# Altium project BMS.PrjPcb
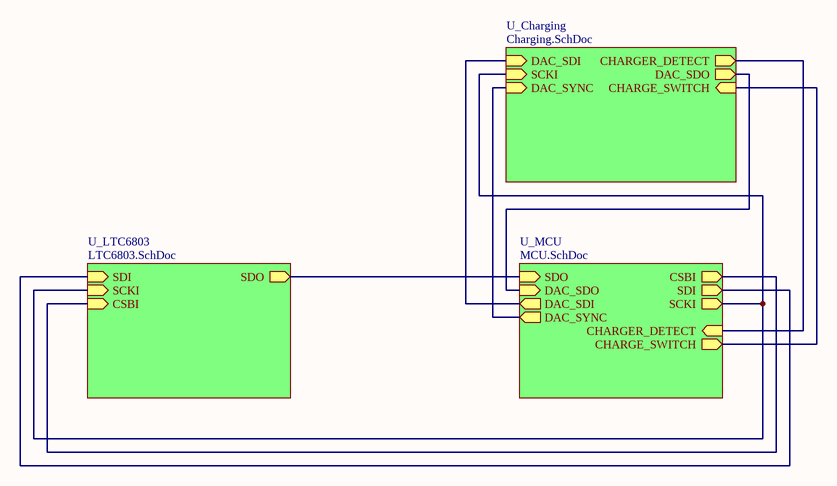
[diagram p0: BMS.SchDoc]
4 sheets, 170 parts. Net scope: hierarchical (ports join the sheet entries above them; power ports are global).
Board file: BMS.PcbDoc
Sheets:
  BMS.SchDoc
    U_LTC6803 = LTC6803.SchDoc
    U_MCU = MCU.SchDoc
    U_Charging = Charging.SchDoc

## Sheet BMS.SchDoc
size A

### Sub-sheets
U_Charging = Charging.SchDoc: CHARGER_DETECT (out), DAC_SDI (in), DAC_SDO (out), DAC_SYNC (in), SCKI (in), CHARGE_SWITCH (in)
U_LTC6803 = LTC6803.SchDoc: SDI (in), SCKI (in), SDO (out), CSBI (in)
U_MCU = MCU.SchDoc: CSBI (out), SDI (out), SDO (in), SCKI (out), DAC_SDO (in), DAC_SYNC (out), DAC_SDI (out), CHARGER_DETECT (in), CHARGE_SWITCH (out)

### Nets
NetR1_2: sheet U_LTC6803/SCKI, sheet U_MCU/SCKI, sheet U_Charging/SCKI
NetR2_2: sheet U_LTC6803/SDI, sheet U_MCU/SDI
NetR3_2: sheet U_LTC6803/CSBI, sheet U_MCU/CSBI
NetR6_2: sheet U_LTC6803/SDO, sheet U_MCU/SDO
NetR50_1: sheet U_MCU/CHARGER_DETECT, sheet U_Charging/CHARGER_DETECT
NetR64_2: sheet U_MCU/CHARGE_SWITCH, sheet U_Charging/CHARGE_SWITCH
NetU3_7: sheet U_MCU/DAC_SDI, sheet U_Charging/DAC_SDI
NetU3_8: sheet U_MCU/DAC_SDO, sheet U_Charging/DAC_SDO
NetU3_9: sheet U_MCU/DAC_SYNC, sheet U_Charging/DAC_SYNC

## Sheet LTC6803.SchDoc
size A
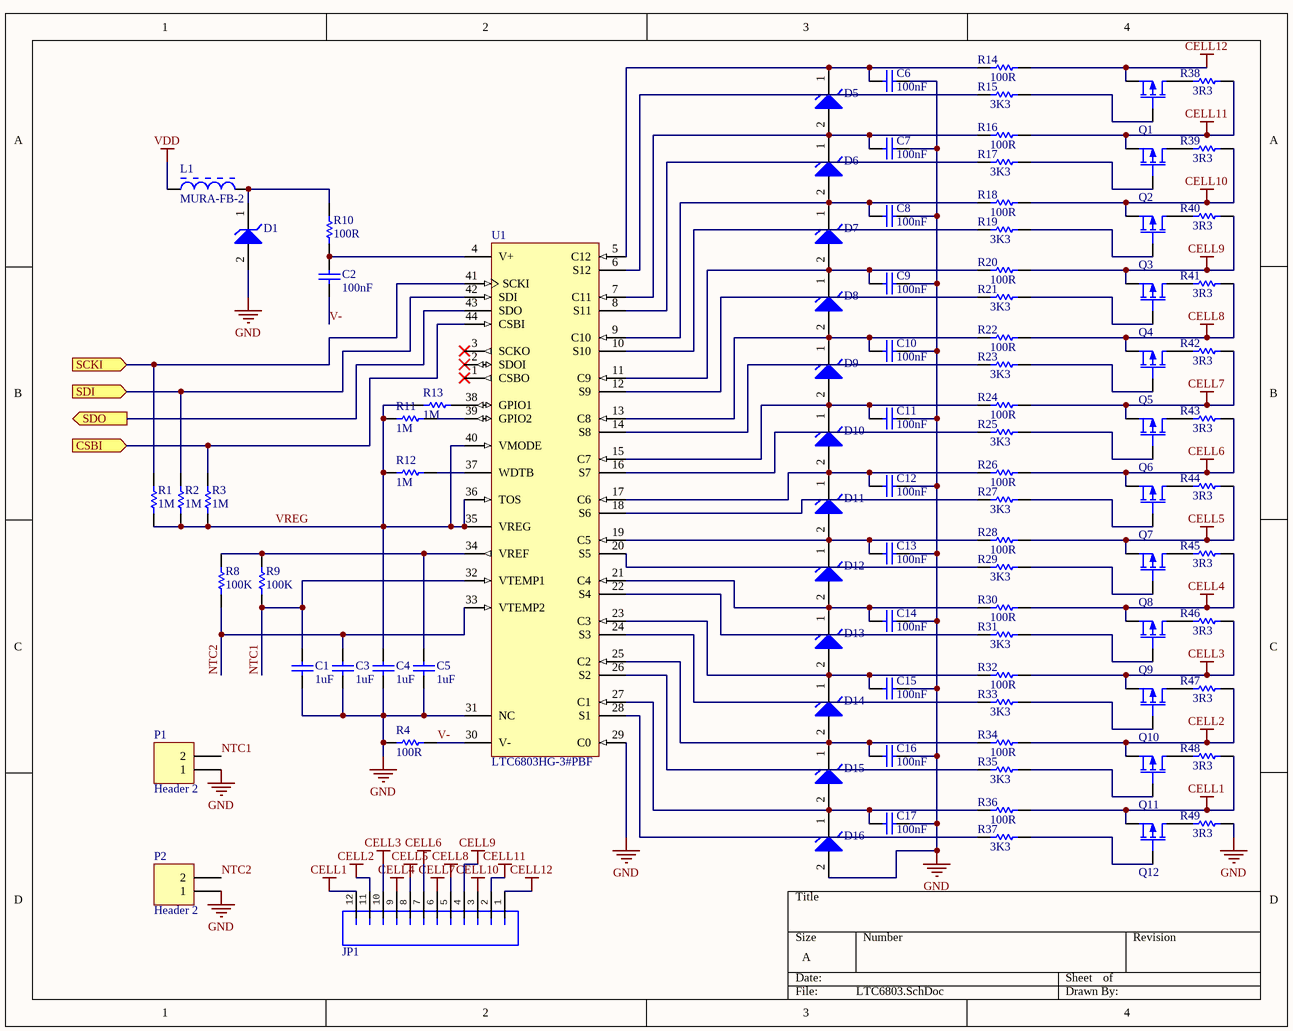
[diagram p1: LTC6803.SchDoc]

### Parts
C1  1uF  [CAPC0603(1608)100_N]
C2  100nF  [CAPC0603(1608)100_L]
C3  1uF  [CAPC0603(1608)100_N]
C4  1uF  [CAPC0603(1608)100_N]
C5  1uF  [CAPC0603(1608)100_N]
C6  100nF  [CAPC0603(1608)100_M]
C7  100nF  [CAPC0603(1608)100_M]
C8  100nF  [CAPC0603(1608)100_M]
C9  100nF  [CAPC0603(1608)100_M]
C10  100nF  [CAPC0603(1608)100_M]
C11  100nF  [CAPC0603(1608)100_M]
C12  100nF  [CAPC0603(1608)100_M]
C13  100nF  [CAPC0603(1608)100_M]
C14  100nF  [CAPC0603(1608)100_M]
C15  100nF  [CAPC0603(1608)100_M]
C16  100nF  [CAPC0603(1608)100_M]
C17  100nF  [CAPC0603(1608)100_M]
D1  (no value)  [SOD-123]
D5  (no value)  [ONSC-SOD-323-2-477-02_V]
D6  (no value)  [ONSC-SOD-323-2-477-02_V]
D7  (no value)  [ONSC-SOD-323-2-477-02_V]
D8  (no value)  [ONSC-SOD-323-2-477-02_V]
D9  (no value)  [ONSC-SOD-323-2-477-02_V]
D10  (no value)  [ONSC-SOD-323-2-477-02_V]
D11  (no value)  [ONSC-SOD-323-2-477-02_V]
D12  (no value)  [ONSC-SOD-323-2-477-02_V]
D13  (no value)  [ONSC-SOD-323-2-477-02_V]
D14  (no value)  [ONSC-SOD-323-2-477-02_V]
D15  (no value)  [ONSC-SOD-323-2-477-02_V]
D16  (no value)  [ONSC-SOD-323-2-477-02_V]
JP1  (no value)  [JST-12-PTH]
L1  MURA-FB-2  [MURA-BLM31-B60-CHIP-2_V1]
P1  Header 2  [HDR1X2]
P2  Header 2  [HDR1X2]
Q1  MOSFET-P  [SOT23-3]  (value not drawn)
Q2  MOSFET-P  [SOT23-3]  (value not drawn)
Q3  MOSFET-P  [SOT23-3]  (value not drawn)
Q4  MOSFET-P  [SOT23-3]  (value not drawn)
Q5  MOSFET-P  [SOT23-3]  (value not drawn)
Q6  MOSFET-P  [SOT23-3]  (value not drawn)
Q7  MOSFET-P  [SOT23-3]  (value not drawn)
Q8  MOSFET-P  [SOT23-3]  (value not drawn)
Q9  MOSFET-P  [SOT23-3]  (value not drawn)
Q10  MOSFET-P  [SOT23-3]  (value not drawn)
Q11  MOSFET-P  [SOT23-3]  (value not drawn)
Q12  MOSFET-P  [SOT23-3]  (value not drawn)
R1  1M  [RESC0603(1608)_L]
R2  1M  [RESC0603(1608)_L]
R3  1M  [RESC0603(1608)_L]
R4  100R  [RESC0603(1608)_L]
R8  100K  [RESC0603(1608)_N]
R9  100K  [RESC0603(1608)_N]
R10  100R  [RESC0603(1608)_L]
R11  1M  [RESC0603(1608)_L]
R12  1M  [RESC0603(1608)_L]
R13  1M  [RESC0603(1608)_L]
R14  100R  [RESC0603(1608)_N]
R15  3K3  [RESC0603(1608)_N]
R16  100R  [RESC0603(1608)_N]
R17  3K3  [RESC0603(1608)_N]
R18  100R  [RESC0603(1608)_N]
R19  3K3  [RESC0603(1608)_N]
R20  100R  [RESC0603(1608)_N]
R21  3K3  [RESC0603(1608)_N]
R22  100R  [RESC0603(1608)_N]
R23  3K3  [RESC0603(1608)_N]
R24  100R  [RESC0603(1608)_N]
R25  3K3  [RESC0603(1608)_N]
R26  100R  [RESC0603(1608)_N]
R27  3K3  [RESC0603(1608)_N]
R28  100R  [RESC0603(1608)_N]
R29  3K3  [RESC0603(1608)_N]
R30  100R  [RESC0603(1608)_N]
R31  3K3  [RESC0603(1608)_N]
R32  100R  [RESC0603(1608)_N]
R33  3K3  [RESC0603(1608)_N]
R34  100R  [RESC0603(1608)_N]
R35  3K3  [RESC0603(1608)_N]
R36  100R  [RESC0603(1608)_N]
R37  3K3  [RESC0603(1608)_N]
R38  3R3  [RESC2512(6432)_N]
R39  3R3  [RESC2512(6432)_N]
R40  3R3  [RESC2512(6432)_N]
R41  3R3  [RESC2512(6432)_N]
R42  3R3  [RESC2512(6432)_N]
R43  3R3  [RESC2512(6432)_N]
R44  3R3  [RESC2512(6432)_N]
R45  3R3  [RESC2512(6432)_N]
R46  3R3  [RESC2512(6432)_N]
R47  3R3  [RESC2512(6432)_N]
R48  3R3  [RESC2512(6432)_N]
R49  3R3  [RESC2512(6432)_N]
U1  LTC6803HG-3#PBF  [LT-G-44_L]

### Ports
CSBI (in), SCKI (in), SDI (in), SDO (out)

### Nets
CELL1: JP1.12 Q12.3(S) R36.2 R48.1
CELL2: JP1.11 Q11.3(S) R34.2 R47.1
CELL3: JP1.10 Q10.3(S) R32.2 R46.1
CELL4: JP1.9 Q9.3(S) R30.2 R45.1
CELL5: JP1.8 Q8.3(S) R28.2 R44.1
CELL6: JP1.7 Q7.3(S) R26.2 R43.1
CELL7: JP1.6 Q6.3(S) R24.2 R42.1
CELL8: JP1.5 Q5.3(S) R22.2 R41.1
CELL9: JP1.4 Q4.3(S) R20.2 R40.1
CELL10: JP1.3 Q3.3(S) R18.2 R39.1
CELL11: JP1.2 Q2.3(S) R16.2 R38.1
CELL12: JP1.1 Q1.3(S) R14.2
GND: C1.1 C3.1 C4.1 C5.1 C6.1 C7.1 C8.1 C9.1 C10.1 C11.1 C12.1 C13.1 C14.1 C15.1 C16.1 C17.1 D1.2(A) D16.2(A) P1.1 P2.1 R4.1 R49.1 U1.29(C0) U1.31(NC)
VDD: L1.1
NTC1: C1.2 P1.2 R9.1 U1.32(VTEMP1)
NTC2: C3.2 P2.2 R8.1 U1.33(VTEMP2)
V-: C2.1 R4.2 U1.30(V-)
VREG: C4.2 R1.1 R2.1 R3.1 R11.1 R12.1 R13.1 U1.35(VREG) U1.36(TOS) U1.40(VMODE)
NetC2_2: C2.2 R10.1 U1.4(V+)
NetC5_2: C5.2 R8.2 R9.2 U1.34(VREF)
NetC6_2: C6.2 D5.1(K) R14.1 U1.5(C12)
NetC7_2: C7.2 D5.2(A) D6.1(K) R16.1 U1.7(C11)
NetC8_2: C8.2 D6.2(A) D7.1(K) R18.1 U1.9(C10)
NetC9_2: C9.2 D7.2(A) D8.1(K) R20.1 U1.11(C9)
NetC10_2: C10.2 D8.2(A) D9.1(K) R22.1 U1.13(C8)
NetC11_2: C11.2 D9.2(A) D10.1(K) R24.1 U1.15(C7)
NetC12_2: C12.2 D10.2(A) D11.1(K) R26.1 U1.17(C6)
NetC13_2: C13.2 D11.2(A) D12.1(K) R28.1 U1.19(C5)
NetC14_2: C14.2 D12.2(A) D13.1(K) R30.1 U1.21(C4)
NetC15_2: C15.2 D13.2(A) D14.1(K) R32.1 U1.23(C3)
NetC16_2: C16.2 D14.2(A) D15.1(K) R34.1 U1.25(C2)
NetC17_2: C17.2 D15.2(A) D16.1(K) R36.1 U1.27(C1)
NetD1_1: D1.1(K) L1.2 R10.2
NetQ1_1: Q1.1(G) R15.2
NetQ1_2: Q1.2(D) R38.2
NetQ2_1: Q2.1(G) R17.2
NetQ2_2: Q2.2(D) R39.2
NetQ3_1: Q3.1(G) R19.2
NetQ3_2: Q3.2(D) R40.2
NetQ4_1: Q4.1(G) R21.2
NetQ4_2: Q4.2(D) R41.2
NetQ5_1: Q5.1(G) R23.2
NetQ5_2: Q5.2(D) R42.2
NetQ6_1: Q6.1(G) R25.2
NetQ6_2: Q6.2(D) R43.2
NetQ7_1: Q7.1(G) R27.2
NetQ7_2: Q7.2(D) R44.2
NetQ8_1: Q8.1(G) R29.2
NetQ8_2: Q8.2(D) R45.2
NetQ9_1: Q9.1(G) R31.2
NetQ9_2: Q9.2(D) R46.2
NetQ10_1: Q10.1(G) R33.2
NetQ10_2: Q10.2(D) R47.2
NetQ11_1: Q11.1(G) R35.2
NetQ11_2: Q11.2(D) R48.2
NetQ12_1: Q12.1(G) R37.2
NetQ12_2: Q12.2(D) R49.2
NetR1_2: R1.2 U1.41(SCKI) ; port SCKI
NetR2_2: R2.2 U1.42(SDI) ; port SDI
NetR3_2: R3.2 U1.44(CSBI) ; port CSBI
NetR6_2: U1.43(SDO) ; port SDO
NetR11_2: R11.2 U1.39(GPIO2)
NetR12_2: R12.2 U1.37(WDTB)
NetR13_2: R13.2 U1.38(GPIO1)
NetR15_1: R15.1 U1.6(S12)
NetR17_1: R17.1 U1.8(S11)
NetR19_1: R19.1 U1.10(S10)
NetR21_1: R21.1 U1.12(S9)
NetR23_1: R23.1 U1.14(S8)
NetR25_1: R25.1 U1.16(S7)
NetR27_1: R27.1 U1.18(S6)
NetR29_1: R29.1 U1.20(S5)
NetR31_1: R31.1 U1.22(S4)
NetR33_1: R33.1 U1.24(S3)
NetR35_1: R35.1 U1.26(S2)
NetR37_1: R37.1 U1.28(S1)

Not connected (* = marked no-connect by the designer): U1 1(CSBO)* 2(SDOI)* 3(SCKO)*

### Library data of the parts
C1 C3-C5 = CMP-1035-02730-1: CAP 1uF 6.3V Â±10% 0603 (1608 Metric) Thickness 1mm SMD; Case-EIA: 0603; Case-Metric: 1608; Rated Voltage: 6.3 V; Max Thickness: 1 mm; Technology: SMT; Tolerance: Â±10%; Value: 1uF
C2 = CMP-1035-02595-1: CAP 100nF 100V Â±10% 0603 (1608 Metric) Thickness 1mm SMD; Case-EIA: 0603; Case-Metric: 1608; Tolerance: Â±10%; Rated Voltage: 100 V; Value: 100nF; Technology: SMT; Max Thickness: 1 mm
C6-C17 = CMP-1035-02575-1: CAP 100nF 6.3V Â±5% 0603 (1608 Metric) Thickness 1mm SMD; Case-Metric: 1608; Case-EIA: 0603; Tolerance: Â±5%; Technology: SMT; Rated Voltage: 6.3 V; Max Thickness: 1 mm; Value: 100nF
D1 = CMHZ5265B
D5-D16 = CMP-1060-00726-1: Zener Voltage Regulator, 300 mW, 2-Pin SOD-323, Tape and Reel; Manufacturer: On Semiconductor; PartNumber: MM3Z12VT1; VZ Typ (V): 12; P Max (W): 0.3; Packing: Tape and Reel; ComponentLink3URL: http://www.onsemi.com/pub_link/Collateral/477-02.PDF.1; ComponentLink2Description: Datasheet; Mounting Technology: Surface Mount; PackageVersion: Rev. H, 03/2007; PackageDescription: 2-Pin SOD, Body 1.7 x 1.25 mm; ComponentLink1URL: http://www.onsemi.com/; ComponentLink1Description: Manufacturer URL; ComponentLink3Description: Package Specification; ComponentLink2URL: http://www.onsemi.cn/pub_link/Collateral/MM3Z2V4T1-D.PDF; DatasheetVersion: Rev. 9; PackageReference: SOD-323-2-477-02
JP1 = JST_12_RIGHT
P1 P2 = Header 2: Header, 2-Pin; LatestRevisionDate: 17-Jul-2002; LatestRevisionNote: Re-released for DXP Platform.; Publisher: Altium Limited
Q1-Q12 = MOSFET-P: P-Channel MOSFET; Published: 8-Jun-2000; LatestRevisionDate: 17-Jul-2002; LatestRevisionNote: Re-released for DXP Platform.; PackageVersion: 1995/1996; PackageReference: E3; Publisher: Altium Limited; PackageDescription: TO, Flat Index; 3 In-Line, Axial Leads; Body Dia. 4.6mm; Lead Dia. 0.5 mm (max)
R1-R3 R11-R13 = CMP-1012-00849-1: 1M 0.1W 1% 0603 (1608 Metric)  SMD; Value: 1000000.00 Ohm; Case-EIA: 0603; Case-Metric: 1608; Power: 0.1 W; Tolerance: 1 %; Technology: SMT
R4 R10 R14 R16 R18 R20 R22 R24 R26 R28 R30 R32 R34 R36 = CMP-1012-00050-1: 100R 0.1W 5% 0603 (1608 Metric)  SMD; Case-EIA: 0603; Value: 100.00 Ohm; Case-Metric: 1608; Tolerance: 5 %; Technology: SMT; Power: 0.1 W
R8 R9 = CMP-1012-00122-1: 100K 0.1W 5% 0603 (1608 Metric)  SMD; Case-EIA: 0603; Value: 100000.00 Ohm; Case-Metric: 1608; Tolerance: 5 %; Power: 0.1 W; Technology: SMT
R15 R17 R19 R21 R23 R25 R27 R29 R31 R33 R35 R37 = CMP-1012-00086-1: 3K3 0.1W 5% 0603 (1608 Metric)  SMD; Case-EIA: 0603; Value: 3300.00 Ohm; Case-Metric: 1608; Technology: SMT; Tolerance: 5 %; Power: 0.1 W
R38-R49 = CMP-1018-00014-1: 3R3 1W 5% 2512 (6432 Metric)  SMD; Value: 3.30 Ohm; Case-EIA: 2512; Case-Metric: 6432; Tolerance: 5 %; Technology: SMT; Power: 1 W
U1 = CMP-0471-00238-1: Multicell Battery Stack Monitor, 60 V Vin MAX, 44-pin SOP (G-44), -40 to 125 degC, Pb-Free; Manufacturer: Linear Technology; Number of Cells: > 1000 V of stacked Li-Ion cells; Vin Max(V): 60; Battery Chemistry: Li-Ion, Supercapacitors, Multi-Chemistry; ComponentLink2URL: http://cds.linear.com/docs/en/datasheet/680313fa.pdf; ComponentLink1URL: http://www.linear.com/; PackageReference: G-44; DatasheetVersion: Rev. A; RoHS: TRUE; Mounting Technology: Surface Mount; ComponentLink3Description: Package Specification; PartNumber: LTC6803HG-3#PBF; Type of Charger: Battery Stack Monitor; PackageVersion: Rev. Ã˜, 06/2010; ComponentLink1Description: Manufacturer URL; PackageDescription: 44-Pin Plastic SSOP, Body 12.8 x 5.3 mm, Pitch 0.5 mm; ComponentLink3URL: http://cds.linear.com/docs/en/packaging/SSOP_44_05-08-1754.pdf; ComponentLink2Description: Datasheet

## Sheet MCU.SchDoc
size A
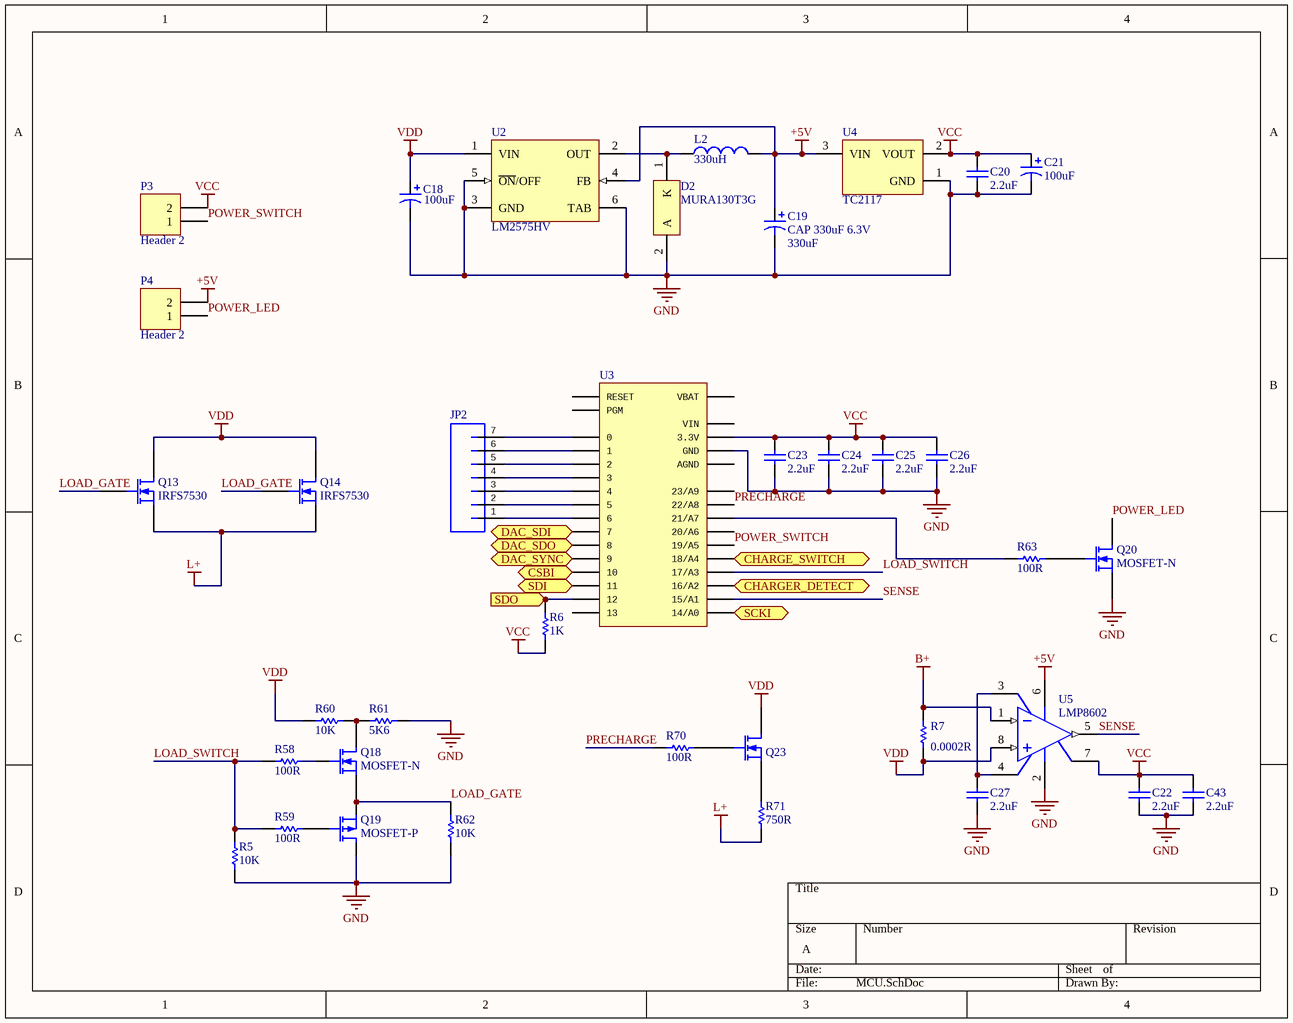
[diagram p2: MCU.SchDoc]

### Parts
C18  value 100uF  [CAP 180uF 50V]
C19  CAP 330uF 6.3V  value 330uF  [CAP 300uF 6.3V]
C20  2.2uF  [CAPC0603(1608)55_N]
C21  100uF  [AVX-CAPC7343_V]
C22  2.2uF  [CAPC0603(1608)55_M]
C23  2.2uF  [CAPC0603(1608)55_N]
C24  2.2uF  [CAPC0603(1608)55_N]
C25  2.2uF  [CAPC0603(1608)55_N]
C26  2.2uF  [CAPC0603(1608)55_N]
C27  2.2uF  [CAPC0603(1608)55_N]
C43  2.2uF  [CAPC0603(1608)55_M]
D2  MURA130T3G  [ONSC-SMA-2-403D-02_V]
JP2  (no value)  [JST-7-PTH]
L2  value 330uH  [SDR1307]
P3  Header 2  [HDR1X2]
P4  Header 2  [HDR1X2]
Q13  IRFS7530  [DPAK127P1525X483-7N]
Q14  IRFS7530  [DPAK127P1525X483-7N]
Q18  MOSFET-N  [SOT23-3]
Q19  MOSFET-P  [SOT23-3]
Q20  MOSFET-N  [SOT23-3]
Q23  MOSFET-N  [SOT23-3]  (value not drawn)
R5  10K  [RESC0603(1608)_N]
R6  1K  [RESC0603(1608)_L]
R7  value 0.0002R  [WSLP5931]
R58  100R  [RESC0603(1608)_L]
R59  100R  [RESC0603(1608)_L]
R60  10K  [RESC0603(1608)_N]
R61  5K6  [RESC0603(1608)_M]
R62  10K  [RESC0603(1608)_N]
R63  100R  [RESC0603(1608)_L]
R70  100R  [RESC0603(1608)_L]
R71  750R  [RESC2512(6432)_N]
U2  LM2575HV  [TS5B_L]
U3  (no value)  [TEENSY_3.0_BASIC]
U4  TC2117  [SOT-223-DB3_M]
U5  LMP8602  [M08A_M]

### Ports
CHARGE_SWITCH (out), CHARGER_DETECT (in), CSBI (out), DAC_SDI (out), DAC_SDO (in), DAC_SYNC (out), SCKI (out), SDI (out), SDO (in)

### Nets
+5V: C19.1 L2.2 P4.2 U2.4(FB) U4.3(VIN) U5.6(VS)
B+: R7.2 U5.1(IN-)
GND: C18.2 C19.2 C20.2 C21.2 C22.1 C23.1 C24.1 C25.1 C26.1 C27.1 C43.1 D2.2(A) Q19.2(D) Q20.3(S) R5.1 R61.1 R62.1 U2.3(GND) U2.5(~{ON}/OFF) U2.6(TAB) U3.GND_GND1(GND) U4.1(GND) U5.2(GND)
L+: Q13.3(S) Q14.3(S) R71.1
VCC: C20.1 C21.1 C22.2 C23.2 C24.2 C25.2 C26.2 C43.2 P3.2 R6.1 U3.3.3V_3.3V1(3.3V) U4.2(VOUT) U5.7(OFS)
VDD: C18.1 Q13.1(D) Q14.1(D) Q23.2(D) R7.1 R60.2 U2.1(VIN) U5.8(IN+)
LOAD_GATE: Q13.2(G) Q14.2(G) Q18.3(S) Q19.3(S) R62.2
LOAD_SWITCH: R5.2 R58.1 R59.1 U3.17/A3
POWER_LED: P4.1 Q20.2(D)
POWER_SWITCH: P3.1 U3.19/A5
PRECHARGE: R70.1 U3.22/A8
SENSE: U3.15/A1 U5.5(OUT)
NetC27_2: C27.2 U5.3(A1) U5.4(A2)
NetD2_1: D2.1(K) L2.1 U2.2(OUT)
NetJP2_1: JP2.1 U3.6
NetJP2_2: JP2.2 U3.5
NetJP2_3: JP2.3 U3.4
NetJP2_4: JP2.4 U3.3
NetJP2_5: JP2.5 U3.2
NetJP2_6: JP2.6 U3.1
NetJP2_7: JP2.7 U3.0
NetQ18_1: Q18.1(G) R58.2
NetQ18_2: Q18.2(D) R60.1 R61.2
NetQ19_1: Q19.1(G) R59.2
NetQ20_1: Q20.1(G) R63.2
NetQ23_1: Q23.1(G) R70.2
NetQ23_3: Q23.3(S) R71.2
NetR1_2: U3.14/A0 ; port SCKI
NetR2_2: U3.11 ; port SDI
NetR3_2: U3.10 ; port CSBI
NetR6_2: R6.2 U3.12 ; port SDO
NetR50_1: U3.16/A2 ; port CHARGER_DETECT
NetR63_1: R63.1 U3.21/A7
NetR64_2: U3.18/A4 ; port CHARGE_SWITCH
NetU3_7: U3.7 ; port DAC_SDI
NetU3_8: U3.8 ; port DAC_SDO
NetU3_9: U3.9 ; port DAC_SYNC

Not connected (* = marked no-connect by the designer): U3 13 20/A6 23/A9 AGND PGM RESET VBAT VIN

### Library data of the parts
C18 = CAP 100uF 63V: Polarized Capacitor (Axial); Published: 8-Jun-2000; LatestRevisionDate: 17-Jul-2002; LatestRevisionNote: Re-released for DXP Platform.; PackageReference: POLAR0.8; Publisher: Altium Limited; PackageDescription: Polarized Capacitor; 2 Leads
C19 = CAP 330uF 6.3V: Polarized Capacitor (Axial); Published: 8-Jun-2000; LatestRevisionDate: 17-Jul-2002; LatestRevisionNote: Re-released for DXP Platform.; PackageReference: POLAR0.8; Publisher: Altium Limited; PackageDescription: Polarized Capacitor; 2 Leads
C20 C23-C27 = CMP-1035-02762-1: CAP 2.2uF 16V Â±10% 0603 (1608 Metric) Thickness 0.55mm SMD; Case-EIA: 0603; Case-Metric: 1608; Max Thickness: 0.55 mm; Technology: SMT; Value: 2.2uF; Rated Voltage: 16 V; Tolerance: Â±10%
C21 = CMP-0279-00002-1: Capacitor, Tantalum, 220uF 10% 10V MCCT-D (7343-31); PartNumber: TAJD227K010R; Manufacturer: AVX; Polarity: Polarized; ComponentLink2URL: http://www.avx.com/docs/Catalogs/taj.pdf; PackageReference: CAPC7343; ComponentLink2Description: Datasheet; ComponentLink1URL: http://www.avx.com/; Mounting Technology: Surface Mount; Technology: Tantalum; Tolerance: 10%; Capacitance: 220uF; Rated Voltage: 10V; PackageDescription: 2-Pin SMT Capacitor, 7.3 x 4.3 mm Body; ComponentLink1Description: Manufacturer URL; DatasheetVersion: Jul-13
C22 C43 = CMP-1035-02751-1: CAP 2.2uF 4V Â±10% 0603 (1608 Metric) Thickness 0.55mm SMD; Case-EIA: 0603; Case-Metric: 1608; Tolerance: Â±10%; Rated Voltage: 4 V; Technology: SMT; Max Thickness: 0.55 mm; Value: 2.2uF
D2 = CMP-0902-00297-1: Surface Mount Ultrafast Power Rectifier, 2-Pin SMA, Pb-Free, Tape and Reel; Manufacturer: On Semiconductor; IFSM Max (A): 35; PackageDescription: 2-Pin Small Molded Package, J-Bend Lead, Body 2.605 x 4.315 mm; ComponentLink1URL: http://www.onsemi.com/; ComponentLink2Description: Datasheet; PackageVersion: Rev. G, 07/2012; PackageReference: SMA-2-403D-02; DatasheetVersion: Rev. 5; Packing: Tape and Reel; ComponentLink2URL: http://www.onsemi.cn/pub_link/Collateral/MURA130T3-D.PDF; Type: Ultrafast; RoHS: TRUE; ComponentLink1Description: Manufacturer URL; ComponentLink3Description: Package Specification; ComponentLink3URL: http://www.onsemi.com/pub_link/Collateral/403D-02.PDF; Mounting Technology: Surface Mount; PartNumber: MURA130T3G
JP2 = JST_7_RIGHT
L2 = SDR1307-331KL: Inductor; Code_IEC: 1005; Published: 8-Jun-2000; LatestRevisionDate: 29-May-2009; LatestRevisionNote: IPC-7351 Footprint Added.; PackageReference: 0402-A; Publisher: Altium Limited; PackageDescription: Chip Inductor; Code_JEITA: 0402
P3 P4 = Header 2: Header, 2-Pin; LatestRevisionDate: 17-Jul-2002; LatestRevisionNote: Re-released for DXP Platform.; Publisher: Altium Limited
Q13 Q14 = IRFS7530: N-Channel MOSFET; pin to pad: 1>8 2>1 3>2+3+5+6+7; Published: 8-Jun-2000; LatestRevisionDate: 17-Jul-2002; LatestRevisionNote: Re-released for DXP Platform.; PackageVersion: 1995/1996; PackageReference: E3; Publisher: Altium Limited; PackageDescription: TO, Flat Index; 3 In-Line, Axial Leads; Body Dia. 4.6mm; Lead Dia. 0.5 mm (max)
Q18 Q20 Q23 = MOSFET-N: N-Channel MOSFET; Published: 8-Jun-2000; LatestRevisionDate: 17-Jul-2002; LatestRevisionNote: Re-released for DXP Platform.; PackageVersion: 1995/1996; PackageReference: E3; Publisher: Altium Limited; PackageDescription: TO, Flat Index; 3 In-Line, Axial Leads; Body Dia. 4.6mm; Lead Dia. 0.5 mm (max)
Q19 = MOSFET-P: P-Channel MOSFET; Published: 8-Jun-2000; LatestRevisionDate: 17-Jul-2002; LatestRevisionNote: Re-released for DXP Platform.; PackageVersion: 1995/1996; PackageReference: E3; Publisher: Altium Limited; PackageDescription: TO, Flat Index; 3 In-Line, Axial Leads; Body Dia. 4.6mm; Lead Dia. 0.5 mm (max)
R5 R62 = CMP-1012-00623-1: 10K 0.1W 1% 0603 (1608 Metric)  SMD; Value: 10000.00 Ohm; Case-EIA: 0603; Case-Metric: 1608; Power: 0.1 W; Tolerance: 1 %; Technology: SMT
R6 = CMP-1012-00074-1: 1K 0.1W 5% 0603 (1608 Metric)  SMD; Case-EIA: 0603; Case-Metric: 1608; Value: 1000.00 Ohm; Technology: SMT; Tolerance: 5 %; Power: 0.1 W
R7 = SHUNT: Resistor; Published: 8-Jun-2000; LatestRevisionDate: 17-Jul-2002; LatestRevisionNote: Re-released for DXP Platform.; PackageReference: AXIAL-0.3; Publisher: Altium Limited; PackageDescription: Axial Device, Thru-Hole; 2 Leads; 0.3 in Pin Spacing
R58 R59 R63 R70 = CMP-1012-00050-1: as R4 on sheet LTC6803; Tolerance: 5 %; Technology: SMT; Power: 0.1 W
R60 = CMP-1012-00098-1: 10K 0.1W 5% 0603 (1608 Metric)  SMD; Case-EIA: 0603; Value: 10000.00 Ohm; Case-Metric: 1608; Technology: SMT; Tolerance: 5 %; Power: 0.1 W
R61 = CMP-1012-00595-1: 5K6 0.1W 1% 0603 (1608 Metric)  SMD; Value: 5600.00 Ohm; Case-Metric: 1608; Case-EIA: 0603; Tolerance: 1 %; Power: 0.1 W; Technology: SMT
R71 = CMP-1018-00496-1: 750R 1W 1% 2512 (6432 Metric)  SMD; Value: 750.00 Ohm; Case-EIA: 2512; Case-Metric: 6432; Tolerance: 1 %; Technology: SMT; Power: 1 W
U2 = CMP-0069-00099-2: SIMPLE SWITCHERÂ® 1A Step-Down Voltage Regulator, 5-pin TO-263, Pb-Free; Manufacturer: National Semiconductor; PackageTopMarking: NSUZXYTTE#*LM2575HVS*-5.0 P+; PowerWise: N; ComponentLink1URL: http://www.national.com/ds/LM/LM2575HV.pdf; ComponentLink2Description: LM2575HV Web Page; ComponentLink1Description: LM2575HV Datasheet; ComponentLink3URL: http://www.national.com/packaging/folders/ts5b.html; DatasheetVersion: Apr-2007; ComponentLink2URL: http://www.national.com/pf/LM/LM2575HV.html; PackageDescription: TO-263, Molded, .400 x .390 x .180in, 5 Lead, .067in Pitch, Surface Mount; PackageVersion: revD, Apr-2005; RoHS: Y; PackageReference: TS5B; CompType: Switcher; Code_JEDEC: MO-169-AB; ComponentLink3Description: TS5B Package Page; RevisionNote: Component URLs added; PinCount: 5
U3 = TEENSY_3.0_BASIC: pin to pad: 3.3V 3.3V1>3.3V+3.3V1 GND GND1>GND+GND1
U4 = PM-LINEREG-TC2117-IL4
U5 = CMP-0055-00659-1: 60V Common Mode, 50 x Gain, Bidirectional Precision Current Sensing Amplifier, 8 pin SOIC NARROW; Manufacturer: National Semiconductor; PowerWise: N; CompType: Amplifiers; PackageTopMarking: NSZXTT*LMP86*02QMA; Code_JEDEC: MS-012-AA; PackageDescription: SOIC Narrow, 4.9 x 3.9 x 1.45mm, 8 Lead, 1.27mm Pitch; RoHS: Y; PinCount: 8; PackageVersion: revM, May-2009; Code_IPC: SOIC127P600-8; DatasheetVersion: Mar-2010; PackageReference: M08A

## Sheet Charging.SchDoc
size A
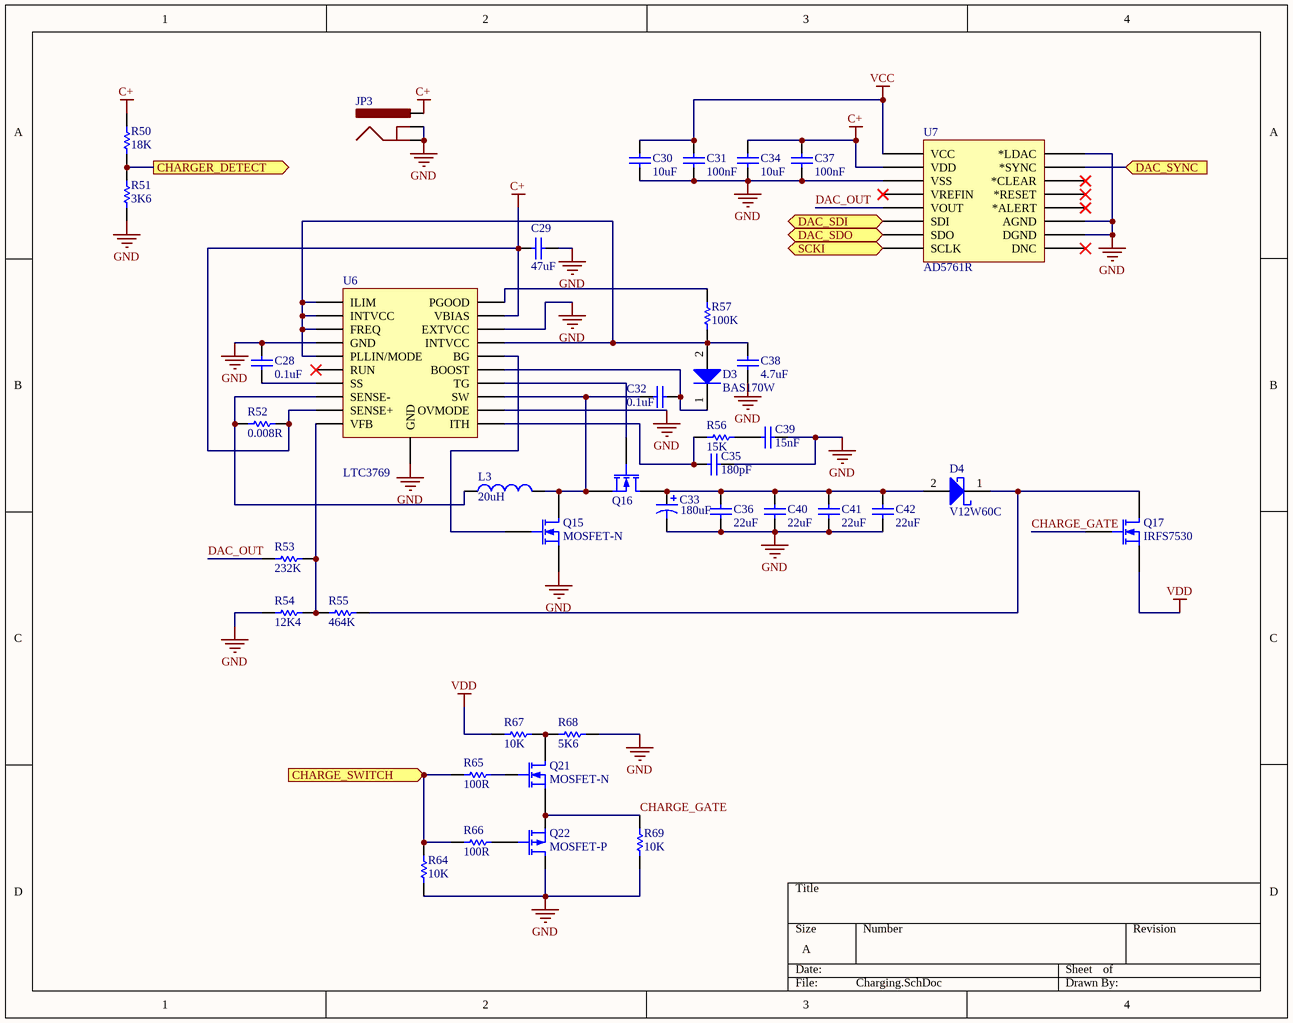
[diagram p3: Charging.SchDoc]

### Parts
C28  0.1uF  [CAPC0603(1608)100_M]
C29  47uF  [CAPC1206(3216)190_M]
C30  10uF  [CAPC0805(2012)145_N]
C31  100nF  [CAPC0603(1608)100_N]
C32  0.1uF  [CAPC0603(1608)100_M]
C33  value 180uF  [CAP 180uF 50V]
C34  10uF  [CAPC0805(2012)145_N]
C35  180pF  [CAPC0603(1608)100_M]
C36  22uF  [CAPC2220(5750)230_N]
C37  100nF  [CAPC0603(1608)100_N]
C38  4.7uF  [CAPC0603(1608)55_M]
C39  15nF  [CAPC0603(1608)100_L]
C40  22uF  [CAPC2220(5750)230_N]
C41  22uF  [CAPC2220(5750)230_N]
C42  22uF  [CAPC2220(5750)230_N]
D3  BAS170W  [INF-SOD323_V]
D4  V12W60C  [DPAK229P1003X238-3N]
JP3  (no value)  [POWER_JACK_SMD_OVERPASTE_REDBOARD_0603]
L3  value 20uH  [Inductor_LR]
Q15  MOSFET-N  [SOIC127P600X175-8N]
Q16  (no value)  [SOIC127P600X175-8N]
Q17  IRFS7530  [DPAK127P1525X483-7N]
Q21  MOSFET-N  [SOT23-3]
Q22  MOSFET-P  [SOT23-3]
R50  18K  [RESC0603(1608)_M]
R51  3K6  [RESC0603(1608)_L]
R52  0.008R  [RESC2010(5025)_L]
R53  232K  [RESC0603(1608)_N]
R54  12K4  [RESC0603(1608)_M]
R55  464K  [RESC0603(1608)_M]
R56  15K  [RESC0603(1608)_M]
R57  100K  [RESC0603(1608)_N]
R64  10K  [RESC0603(1608)_N]
R65  100R  [RESC0603(1608)_L]
R66  100R  [RESC0603(1608)_L]
R67  10K  [RESC0603(1608)_N]
R68  5K6  [RESC0603(1608)_M]
R69  10K  [RESC0603(1608)_N]
U6  LTC3769  [TSOP65P640X120_HS-21N]
U7  AD5761R  [RU_16]

### Ports
CHARGE_SWITCH (in), CHARGER_DETECT (out), DAC_SDI (in), DAC_SDO (out), DAC_SYNC (in), SCKI (in)

### Nets
C+: C29.1 C34.2 C37.2 JP3.VIN0(PWR) R50.2 R52.2 U6.9(SENSE+) U6.19(VBIAS) U7.8(VDD)
GND: C28.2 C29.2 C30.1 C31.1 C33.2 C34.1 C35.2 C36.1 C37.1 C38.1 C39.2 C40.1 C41.1 C42.1 JP3.GND(GNDBREAK) JP3.P$4(GND) Q15.3(S) Q22.2(D) R51.1 R54.1 R64.1 R68.1 R69.1 U6.4(GND) U6.12(OVMODE) U6.18(EXTVCC) U6.21(GND) U7.5(AGND) U7.6(VSS) U7.11(*LDAC) U7.16(DGND)
VCC: C30.2 C31.2 U7.15(VCC)
VDD: Q17.3(S) R67.2
CHARGE_GATE: Q17.2(G) Q21.3(S) Q22.3(S) R69.2
DAC_OUT: R53.1 U7.7(VOUT)
NetC28_1: C28.1 U6.7(SS)
NetC32_1: C32.1 L3.2 Q15.2(D) Q16.3(S) U6.13(SW)
NetC32_2: C32.2 D3.1(K) U6.15(BOOST)
NetC33_1: C33.1 C36.2 C40.2 C41.2 C42.2 D4.2(A) Q16.2(D)
NetC35_1: C35.1 R56.1 U6.11(ITH)
NetC38_2: C38.2 D3.2(A) R57.1 U6.1(ILIM) U6.2(INTVCC) U6.3(FREQ) U6.5(PLLIN/MODE) U6.17(INTVCC)
NetC39_1: C39.1 R56.2
NetD4_1: D4.1(K) Q17.1(D) R55.2
NetL3_1: L3.1 R52.1 U6.8(SENSE-)
NetQ15_1: Q15.1(G) U6.16(BG)
NetQ16_1: Q16.1(G) U6.14(TG)
NetQ21_1: Q21.1(G) R65.2
NetQ21_2: Q21.2(D) R67.1 R68.2
NetQ22_1: Q22.1(G) R66.2
NetR1_2: U7.14(SCLK) ; port SCKI
NetR50_1: R50.1 R51.2 ; port CHARGER_DETECT
NetR53_2: R53.2 R54.2 R55.1 U6.10(VFB)
NetR57_2: R57.2 U6.20(PGOOD)
NetR64_2: R64.2 R65.1 R66.1 ; port CHARGE_SWITCH
NetU3_7: U7.12(SDI) ; port DAC_SDI
NetU3_8: U7.10(SDO) ; port DAC_SDO
NetU3_9: U7.13(*SYNC) ; port DAC_SYNC

Not connected (* = marked no-connect by the designer): U6 6(RUN)*; U7 1(*ALERT)* 2(*CLEAR)* 3(*RESET)* 4(VREFIN)* 9(DNC)*

### Library data of the parts
C28 C32 = CMP-1035-02575-1: as C6 on sheet LTC6803; Tolerance: Â±5%; Technology: SMT; Rated Voltage: 6.3 V; Max Thickness: 1 mm; Value: 100nF
C29 = CMP-1037-04995-1: CAP 22uF 25V Â±20% 1206 (3216 Metric) Thickness 1.9mm SMD; Case-EIA: 1206; Case-Metric: 3216; Tolerance: Â±20%; Rated Voltage: 25 V; Technology: SMT; Max Thickness: 1.9 mm; Value: 22uF
C30 C34 = CMP-1036-04932-1: CAP 10uF 25V Â±10% 0805 (2012 Metric) Thickness 1.45mm SMD; Case-EIA: 0805; Case-Metric: 2012; Technology: SMT; Value: 10uF; Rated Voltage: 25 V; Max Thickness: 1.45 mm; Tolerance: Â±10%
C31 C37 = CMP-1035-02587-1: CAP 100nF 25V Â±5% 0603 (1608 Metric) Thickness 1mm SMD; Case-EIA: 0603; Case-Metric: 1608; Technology: SMT; Tolerance: Â±5%; Max Thickness: 1 mm; Rated Voltage: 25 V; Value: 100nF
C33 = CAP 180uF 50V: Polarized Capacitor (Axial); Published: 8-Jun-2000; LatestRevisionDate: 17-Jul-2002; LatestRevisionNote: Re-released for DXP Platform.; PackageReference: POLAR0.8; Publisher: Altium Limited; PackageDescription: Polarized Capacitor; 2 Leads
C35 = CMP-1035-01398-1: CAP 180pF 6.3V Â±5% 0603 (1608 Metric) Thickness 1mm SMD; Case-Metric: 1608; Case-EIA: 0603; Tolerance: Â±5%; Technology: SMT; Max Thickness: 1 mm; Rated Voltage: 6.3 V; Value: 180pF
C36 C40-C42 = CMP-1042-00782-1: CAP 22uF 50V -20% to +80% 2220 (5750 Metric) Thickness 2.2mm SMD; Case-EIA: 2220; Case-Metric: 5750; Max Thickness: 2.2 mm; Tolerance: -20% to +80%; Technology: SMT; Rated Voltage: 50 V; Value: 22uF
C38 = CMP-1035-02779-1: CAP 4.7uF 6.3V Â±10% 0603 (1608 Metric) Thickness 0.55mm SMD; Case-EIA: 0603; Case-Metric: 1608; Technology: SMT; Tolerance: Â±10%; Value: 4.7uF; Max Thickness: 0.55 mm; Rated Voltage: 6.3 V
C39 = CMP-1035-02358-1: CAP 15nF 6.3V Â±5% 0603 (1608 Metric) Thickness 1mm SMD; Case-Metric: 1608; Case-EIA: 0603; Rated Voltage: 6.3 V; Value: 15nF; Tolerance: Â±5%; Technology: SMT; Max Thickness: 1 mm
D3 = CMP-1182-00005-1: Silicon Schottky Diode, -55 to 125 degC, SOD323, Reel, Green; Manufacturer: Infineon; Green: TRUE; VF (max): 1,000Â mV; VR (max): 70Â V; Configuration: Single; CT (max): 2Â pF; IF (max): 70Â mA; PackageReference: SOD323; PartNumber: BAS170W; ComponentLink3URL: http://www.infineon.com/dgdl/SOD323-Package_Overview.pdf?folderId=db3a30431936bc4b011952aab84f3bbe&fileId=db3a30431936bc4b011952beed653be3; PackageDescription: 2-Pin Small Outline Diode Package, 1.25 x 1.7 mm Body; ComponentLink2URL: http://www.infineon.com/dgdl/bas70_bas170series.pdf?folderId=db3a30431400ef68011425f1ca2505e3&fileId=db3a304314dca389011518ad41680e12; ComponentLink3Description: Package Specification; ComponentLink1URL: http://www.infineon.com/; ComponentLink1Description: Manufacturer URL; Packing: Reel; ComponentLink2Description: Datasheet; Mounting Technology: Surface Mount
D4 = V12W60C: pin to pad: 1>2 2>1
JP3 = POWER_JACK1
L3 = CTX20-7-52LP-R: Inductor; Code_IEC: 1005; Published: 8-Jun-2000; LatestRevisionDate: 29-May-2009; LatestRevisionNote: IPC-7351 Footprint Added.; PackageReference: 0402-A; Publisher: Altium Limited; PackageDescription: Chip Inductor; Code_JEITA: 0402
Q15 Q16 = MOSFET-N: N-Channel MOSFET; pin to pad: 1>2 2>3 3>1; Published: 8-Jun-2000; LatestRevisionDate: 17-Jul-2002; LatestRevisionNote: Re-released for DXP Platform.; PackageVersion: 1995/1996; PackageReference: E3; Publisher: Altium Limited; PackageDescription: TO, Flat Index; 3 In-Line, Axial Leads; Body Dia. 4.6mm; Lead Dia. 0.5 mm (max)
Q17 = IRFS7530: N-Channel MOSFET; pin to pad: 1>8 2>1 3>2+3+5+6+7; Published: 8-Jun-2000; LatestRevisionDate: 17-Jul-2002; LatestRevisionNote: Re-released for DXP Platform.; PackageVersion: 1995/1996; PackageReference: E3; Publisher: Altium Limited; PackageDescription: TO, Flat Index; 3 In-Line, Axial Leads; Body Dia. 4.6mm; Lead Dia. 0.5 mm (max)
Q21 = MOSFET-N: N-Channel MOSFET; Published: 8-Jun-2000; LatestRevisionDate: 17-Jul-2002; LatestRevisionNote: Re-released for DXP Platform.; PackageVersion: 1995/1996; PackageReference: E3; Publisher: Altium Limited; PackageDescription: TO, Flat Index; 3 In-Line, Axial Leads; Body Dia. 4.6mm; Lead Dia. 0.5 mm (max)
Q22 = MOSFET-P: P-Channel MOSFET; Published: 8-Jun-2000; LatestRevisionDate: 17-Jul-2002; LatestRevisionNote: Re-released for DXP Platform.; PackageVersion: 1995/1996; PackageReference: E3; Publisher: Altium Limited; PackageDescription: TO, Flat Index; 3 In-Line, Axial Leads; Body Dia. 4.6mm; Lead Dia. 0.5 mm (max)
R50 = CMP-1012-00650-1: 18K 0.1W 1% 0603 (1608 Metric)  SMD; Value: 18000.00 Ohm; Case-EIA: 0603; Case-Metric: 1608; Power: 0.1 W; Tolerance: 1 %; Technology: SMT
R51 = CMP-1012-00572-1: 3K6 0.1W 1% 0603 (1608 Metric)  SMD; Case-Metric: 1608; Value: 3600.00 Ohm; Case-EIA: 0603; Tolerance: 1 %; Technology: SMT; Power: 0.1 W
R52 = CMP-1017-00002-1: 1R 0.75W 5% 2010 (5025 Metric)  SMD; Case-Metric: 5025; Case-EIA: 2010; Value: 1.00 Ohm; Tolerance: 5 %; Technology: SMT; Power: 0.75 W
R53 = CMP-1012-00775-1: 232K 0.1W 1% 0603 (1608 Metric)  SMD; Case-EIA: 0603; Case-Metric: 1608; Value: 232000.00 Ohm; Technology: SMT; Tolerance: 1 %; Power: 0.1 W
R54 = CMP-1012-00633-1: 12K4 0.1W 1% 0603 (1608 Metric)  SMD; Case-EIA: 0603; Value: 12400.00 Ohm; Case-Metric: 1608; Power: 0.1 W; Tolerance: 1 %; Technology: SMT
R55 = CMP-1012-00811-1: 464K 0.1W 1% 0603 (1608 Metric)  SMD; Value: 464000.00 Ohm; Case-Metric: 1608; Case-EIA: 0603; Tolerance: 1 %; Power: 0.1 W; Technology: SMT
R56 = CMP-1012-00102-1: 15K 0.1W 5% 0603 (1608 Metric)  SMD; Value: 15000.00 Ohm; Case-Metric: 1608; Case-EIA: 0603; Power: 0.1 W; Technology: SMT; Tolerance: 5 %
R57 = CMP-1012-00122-1: as R8 on sheet LTC6803; Tolerance: 5 %; Power: 0.1 W; Technology: SMT
R64 R69 = CMP-1012-00623-1: as R5 on sheet MCU; Power: 0.1 W; Tolerance: 1 %; Technology: SMT
R65 R66 = CMP-1012-00050-1: as R4 on sheet LTC6803; Tolerance: 5 %; Technology: SMT; Power: 0.1 W
R67 = CMP-1012-00098-1: as R60 on sheet MCU; Technology: SMT; Tolerance: 5 %; Power: 0.1 W
R68 = CMP-1012-00595-1: as R61 on sheet MCU; Tolerance: 1 %; Power: 0.1 W; Technology: SMT
U6 = LTC3769: pin to pad: 2>2+17 4>4+21 17>2+17 21>4+21
U7 = AD5761BRUZ: Imported; RefDes: RefDes; Type: DEV; Value: Value

## Nets that join several sheets
GND: LTC6803 (24 pins), MCU (23 pins), Charging (31 pins)
VCC: MCU (13 pins), Charging (C30.2 C31.2 U7.15)
VDD: LTC6803 (L1.1), MCU (8 pins), Charging (Q17.3 R67.2)
NetR1_2: LTC6803 (R1.2 U1.41), MCU (U3.14/A0), Charging (U7.14)
NetR2_2: LTC6803 (R2.2 U1.42), MCU (U3.11)
NetR3_2: LTC6803 (R3.2 U1.44), MCU (U3.10)
NetR6_2: LTC6803 (U1.43), MCU (R6.2 U3.12)
NetR50_1: MCU (U3.16/A2), Charging (R50.1 R51.2)
NetR64_2: MCU (U3.18/A4), Charging (R64.2 R65.1 R66.1)
NetU3_7: MCU (U3.7), Charging (U7.12)
NetU3_8: MCU (U3.8), Charging (U7.10)
NetU3_9: MCU (U3.9), Charging (U7.13)